# Altium schematic sheet 06-SD_CARD.SchDoc
size B
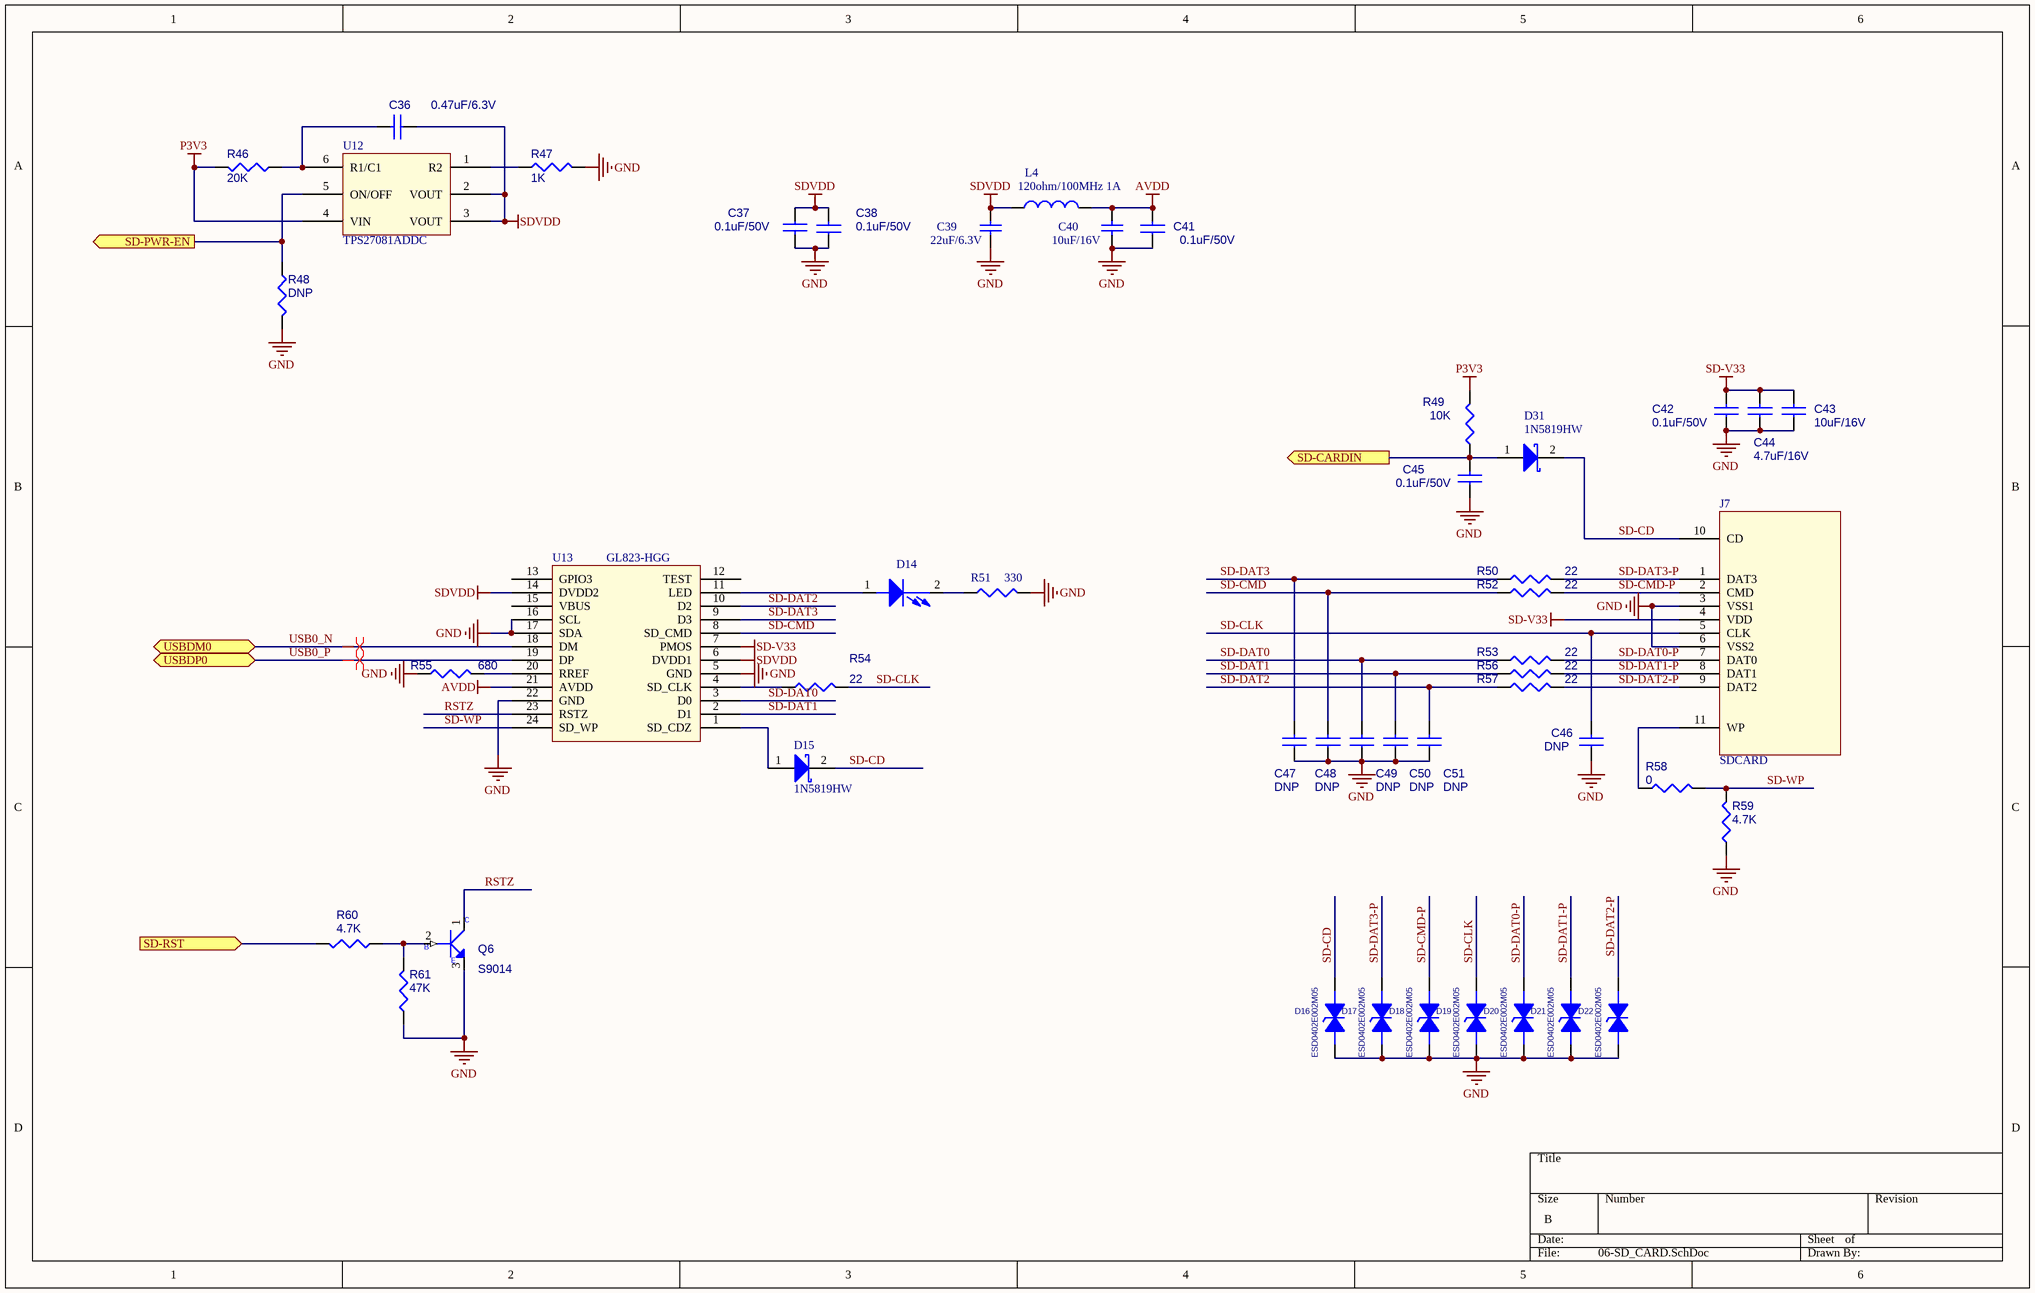
[diagram p0: 06-SD_CARD.SchDoc]

## Parts
C36  0.47uF/6.3V  [0402]
C37  0.1uF/50V  [0402]
C38  0.1uF/50V  [0402]
C39  22uF/6.3V  [0805]
C40  10uF/16V  [0805]
C41  0.1uF/50V  [0402]
C42  0.1uF/50V  [0402]
C43  10uF/16V  [0805]
C44  4.7uF/16V  [0805]
C45  0.1uF/50V  [0402]
C46  DNP  [0402]
C47  DNP  [0402]
C48  DNP  [0402]
C49  DNP  [0402]
C50  DNP  [0402]
C51  DNP  [0402]
D14  LED GREEN  [LED0603]  (value not drawn)
D15  1N5819HW  [1N5819]
D16  ESD0402E002M05  [0402]
D17  ESD0402E002M05  [0402]
D18  ESD0402E002M05  [0402]
D19  ESD0402E002M05  [0402]
D20  ESD0402E002M05  [0402]
D21  ESD0402E002M05  [0402]
D22  ESD0402E002M05  [0402]
D31  1N5819HW  [1N5819]
J7  SDCARD  [SDCARD]
L4  120ohm/100MHz 1A  [0603]
Q6  S9014  [NPN]
R46  20K  [0402]
R47  1K  [0402]
R48  DNP  [0402]
R49  10K  [0402]
R50  22  [0402]
R51  330  [0402]
R52  22  [0402]
R53  22  [0402]
R54  22  [0402]
R55  680  [0402]
R56  22  [0402]
R57  22  [0402]
R58  0  [0402]
R59  4.7K  [0402]
R60  4.7K  [0402]
R61  47K  [0402]
U12  TPS27081ADDC  [SOT23-6]
U13  GL823-HGG  [SSOP24]

## Ports
SD-CARDIN (out), SD-PWR-EN (out), SD-RST (in), USBDM0 (bidir), USBDP0 (bidir)

## Nets
AVDD: C40.1 C41.2 L4.2 U13.21(AVDD)
GND: C37.2 C38.1 C39.2 C40.2 C41.1 C42.1 C43.1 C44.1 C45.1 C46.1 C47.1 C48.1 C49.1 C50.1 C51.1 D16.1 D17.1 D18.1 D19.1 D20.1 D21.1 D22.1 J7.3(VSS1) J7.6(VSS2) Q6.3(EMITTER) R47.1 R48.1 R51.1 R55.2 R59.2 R61.2 U13.5(GND) U13.16(SCL) U13.17(SDA) U13.22(GND)
P3V3: R46.1 R49.1 U12.4(VIN)
SD-V33: C42.2 C43.2 C44.2 J7.4(VDD) U13.7(PMOS)
SDVDD: C36.1 C37.1 C38.2 C39.1 L4.1 U12.2(VOUT) U12.3(VOUT) U13.6(DVDD1) U13.14(DVDD2)
RSTZ: Q6.1(COLLECTOR) U13.23(RSTZ)
SD-CARDIN: C45.2 D31.1(A) R49.2 ; port SD-CARDIN
SD-CD: D15.2(K) D16.2 D31.2(K) J7.10(CD)
SD-CLK: C46.2 D19.2 J7.5(CLK) R54.1
SD-CMD: C48.2 R52.2 U13.8(SD_CMD)
SD-CMD-P: D18.2 J7.2(CMD) R52.1
SD-DAT0: C49.2 R53.2 U13.3(D0)
SD-DAT0-P: D20.2 J7.7(DAT0) R53.1
SD-DAT1: C50.2 R56.2 U13.2(D1)
SD-DAT1-P: D21.2 J7.8(DAT1) R56.1
SD-DAT2: C51.2 R57.2 U13.10(D2)
SD-DAT2-P: D22.2 J7.9(DAT2) R57.1
SD-DAT3: C47.2 R50.2 U13.9(D3)
SD-DAT3-P: D17.2 J7.1(DAT3) R50.1
SD-PWR-EN: R48.2 U12.5(ON/OFF) ; port SD-PWR-EN
SD-RST: R60.1 ; port SD-RST
SD-WP: R58.1 R59.1 U13.24(SD_WP)
USB0_N: U13.18(DM) ; port USBDM0
USB0_P: U13.19(DP) ; port USBDP0
NetC36_2: C36.2 R46.2 U12.6(R1/C1)
NetD14_1: D14.1(ANODE) U13.11(LED)
NetD14_2: D14.2(CATHODE) R51.2
NetD15_1: D15.1(A) U13.1(SD_CDZ)
NetJ7_11: J7.11(WP) R58.2
NetQ6_2: Q6.2(BASE) R60.2 R61.1
NetR47_2: R47.2 U12.1(R2)
NetR54_2: R54.2 U13.4(SD_CLK)
NetR55_1: R55.1 U13.20(RREF)

Not connected (* = marked no-connect by the designer): U13 12(TEST) 13(GPIO3) 15(VBUS)

## Layout directives
differential pair: USB0_N, USB0_P

## Notes on the sheet
- (in symbol MMBT3904_NL_SOT23-3) C; B; E

## Library data of the parts
C36 = P_CAP NP
C37 C38 C41-C51 = CAP
C39 C40 = Cap: Capacitor; Published: 8-Jun-2000; LatestRevisionDate: 17-Jul-2002; LatestRevisionNote: Re-released for DXP Platform.; PackageReference: RAD-0.3; Publisher: Altium Limited; PackageDescription: Radial Cap, Thru-Hole; 2 Leads; 0.3 in Pin Spacing
D14 = LN01401_1
D15 D31 = Diode 11DQ03: Schottky Rectifier
D16-D22 = PESD
L4 = Inductor: Code_IEC: 1005; Value: 300ohm/100MHz BEAD; Published: 8-Jun-2000; LatestRevisionDate: 29-May-2009; LatestRevisionNote: IPC-7351 Footprint Added.; PackageReference: 0402-A; Publisher: Altium Limited; PackageDescription: Chip Inductor; Code_JEITA: 0402
Q6 = MMBT3904_NL_SOT23-3: Part Description: S TR MMBT3904_NL NPN SOT23; Part Number: SB039040000
R46-R50 R52-R61 = P_R
R51 = CR16-1003FM
U12 = TPS27081A
U13 = GL823